# Altium schematic sheet eps.SchDoc: Power Top Level
size A; DrawnBy: J. Reimer T. Yeung M. Hirole; Organization: UTAT SS; DocumentNumber: 2; Revision: 1.0; SheetNumber: 2; SheetTotal: 17
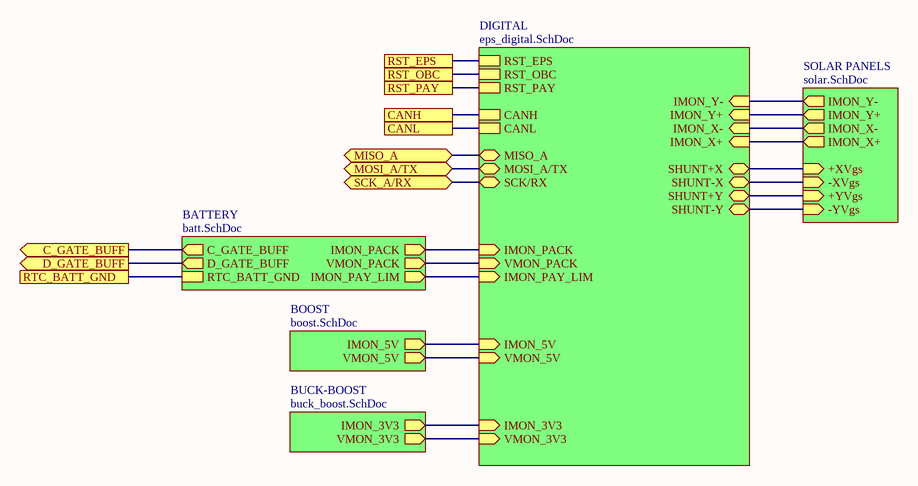
[diagram p0: eps.SchDoc]

## Sub-sheets
BATTERY = batt.SchDoc: IMON_PACK (out), VMON_PACK (out), RTC_BATT_GND, C_GATE_BUFF (out), D_GATE_BUFF (out), IMON_PAY_LIM (out)
BOOST = boost.SchDoc: VMON_5V (out), IMON_5V (out)
BUCK-BOOST = buck_boost.SchDoc: IMON_3V3 (out), VMON_3V3 (out)
DIGITAL = eps_digital.SchDoc: RST_EPS, RST_OBC, RST_PAY, CANH, CANL, MISO_A (bidir), MOSI_A/TX (bidir), SCK/RX (bidir), VMON_5V (in), IMON_5V (in), IMON_3V3 (in), IMON_X+ (in), IMON_X- (in), IMON_Y+ (in), VMON_PACK (in), IMON_Y- (in), SHUNT-Y (bidir), SHUNT+Y (bidir), VMON_3V3 (in), SHUNT-X (bidir), SHUNT+X (bidir), IMON_PACK (in), IMON_PAY_LIM (in)
SOLAR PANELS = solar.SchDoc: IMON_Y+ (out), IMON_Y- (out), -YVgs (in), IMON_X+ (out), +YVgs (in), +XVgs (in), -XVgs (in), IMON_X- (out)

## Ports
C_GATE_BUFF (out), CANH, CANL, D_GATE_BUFF (out), MISO_A (bidir), MOSI_A/TX (bidir), RST_EPS, RST_OBC, RST_PAY, RTC_BATT_GND, SCK_A/RX (bidir)

## Nets
C_GATE_BUFF: port C_GATE_BUFF, sheet BATTERY/C_GATE_BUFF
CANH: port CANH, sheet DIGITAL/CANH
CANL: port CANL, sheet DIGITAL/CANL
D_GATE_BUFF: port D_GATE_BUFF, sheet BATTERY/D_GATE_BUFF
MISO_A: port MISO_A, sheet DIGITAL/MISO_A
MOSI_A/TX: port MOSI_A/TX, sheet DIGITAL/MOSI_A/TX
RST_EPS: port RST_EPS, sheet DIGITAL/RST_EPS
RST_OBC: port RST_OBC, sheet DIGITAL/RST_OBC
RST_PAY: port RST_PAY, sheet DIGITAL/RST_PAY
RTC_BATT_GND: port RTC_BATT_GND, sheet BATTERY/RTC_BATT_GND
SCK_A/RX: port SCK_A/RX, sheet DIGITAL/SCK/RX
(unnamed): sheet DIGITAL/VMON_5V, sheet BOOST/VMON_5V
(unnamed): sheet DIGITAL/IMON_5V, sheet BOOST/IMON_5V
(unnamed): sheet DIGITAL/IMON_3V3, sheet BUCK-BOOST/IMON_3V3
(unnamed): sheet DIGITAL/IMON_X+, sheet SOLAR PANELS/IMON_X+
(unnamed): sheet DIGITAL/IMON_X-, sheet SOLAR PANELS/IMON_X-
(unnamed): sheet DIGITAL/IMON_Y+, sheet SOLAR PANELS/IMON_Y+
(unnamed): sheet DIGITAL/VMON_PACK, sheet BATTERY/VMON_PACK
(unnamed): sheet DIGITAL/IMON_Y-, sheet SOLAR PANELS/IMON_Y-
(unnamed): sheet DIGITAL/SHUNT-Y, sheet SOLAR PANELS/-YVgs
(unnamed): sheet DIGITAL/SHUNT+Y, sheet SOLAR PANELS/+YVgs
(unnamed): sheet DIGITAL/VMON_3V3, sheet BUCK-BOOST/VMON_3V3
(unnamed): sheet DIGITAL/SHUNT-X, sheet SOLAR PANELS/-XVgs
(unnamed): sheet DIGITAL/SHUNT+X, sheet SOLAR PANELS/+XVgs
(unnamed): sheet DIGITAL/IMON_PACK, sheet BATTERY/IMON_PACK
(unnamed): sheet DIGITAL/IMON_PAY_LIM, sheet BATTERY/IMON_PAY_LIM